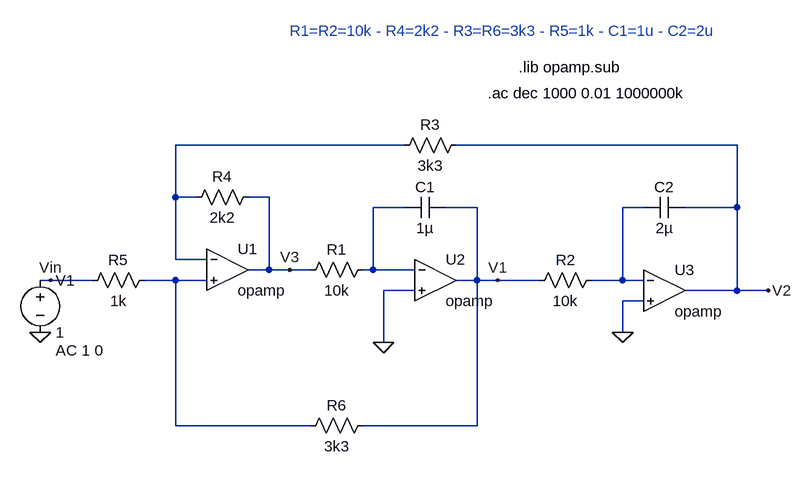
[diagram p0: schematic Ex5.asc]
Ex5.asc, the LTspice schematic file:
Version 4
SHEET 1 992 680
WIRE 384 -80 32 -80
WIRE 896 -80 464 -80
WIRE 32 0 32 -80
WIRE 64 0 32 0
WIRE 176 0 144 0
WIRE 384 16 336 16
WIRE 496 16 448 16
WIRE 752 16 720 16
WIRE 896 16 896 -80
WIRE 896 16 816 16
WIRE 32 96 32 0
WIRE 80 96 32 96
WIRE 176 112 176 0
WIRE 176 112 144 112
WIRE 208 112 176 112
WIRE 240 112 208 112
WIRE 336 112 336 16
WIRE 336 112 320 112
WIRE 400 112 336 112
WIRE -160 128 -176 128
WIRE -96 128 -160 128
WIRE 32 128 -16 128
WIRE 80 128 32 128
WIRE 496 128 496 16
WIRE 496 128 464 128
WIRE 528 128 496 128
WIRE 592 128 528 128
WIRE 720 128 720 16
WIRE 720 128 672 128
WIRE 752 128 720 128
WIRE 400 144 352 144
WIRE 896 144 896 16
WIRE 896 144 816 144
WIRE 944 144 896 144
WIRE 752 160 720 160
WIRE 720 208 720 160
WIRE 352 224 352 144
WIRE 32 352 32 128
WIRE 240 352 32 352
WIRE 496 352 496 128
WIRE 496 352 320 352
FLAG -176 208 0
FLAG 352 224 0
FLAG 720 208 0
FLAG 944 144 V2
FLAG 528 128 V1
FLAG 208 112 V3
FLAG -160 128 Vin
SYMBOL OpAmps\\opamp 112 48 R0
SYMATTR InstName U1
SYMBOL OpAmps\\opamp 432 64 R0
SYMATTR InstName U2
SYMBOL OpAmps\\opamp 784 80 R0
SYMATTR InstName U3
SYMBOL res 0 112 R90
WINDOW 0 0 56 VBottom 2
WINDOW 3 32 56 VTop 2
SYMATTR InstName R5
SYMATTR Value 1k
SYMBOL res 336 96 R90
WINDOW 0 0 56 VBottom 2
WINDOW 3 32 56 VTop 2
SYMATTR InstName R1
SYMATTR Value 10k
SYMBOL res 688 112 R90
WINDOW 0 0 56 VBottom 2
WINDOW 3 32 56 VTop 2
SYMATTR InstName R2
SYMATTR Value 10k
SYMBOL res 336 336 R90
WINDOW 0 0 56 VBottom 2
WINDOW 3 32 56 VTop 2
SYMATTR InstName R6
SYMATTR Value 3k3
SYMBOL res 160 -16 R90
WINDOW 0 0 56 VBottom 2
WINDOW 3 32 56 VTop 2
SYMATTR InstName R4
SYMATTR Value 2k2
SYMBOL res 480 -96 R90
WINDOW 0 0 56 VBottom 2
WINDOW 3 32 56 VTop 2
SYMATTR InstName R3
SYMATTR Value 3k3
SYMBOL cap 448 0 R90
WINDOW 0 0 32 VBottom 2
WINDOW 3 32 32 VTop 2
SYMATTR InstName C1
SYMATTR Value 1µ
SYMBOL cap 816 0 R90
WINDOW 0 0 32 VBottom 2
WINDOW 3 32 32 VTop 2
SYMATTR InstName C2
SYMATTR Value 2µ
SYMBOL voltage -176 112 R0
WINDOW 123 24 124 Left 2
WINDOW 39 0 0 Left 0
SYMATTR InstName V1
SYMATTR Value 1
SYMATTR Value2 AC 1 0
TEXT 560 -200 Left 2 !.lib opamp.sub
TEXT 512 -160 Left 2 !.ac dec 1000 0.01 1000000k
TEXT 208 -256 Left 2 ;R1=R2=10k - R4=2k2 - R3=R6=3k3 - R5=1k - C1=1u - C2=2u

The netlist it stands for:
* Ex5.asc
XU1 N001 N004 V3 opamp Aol=100K GBW=10Meg  ; pins invin noninvin out
XU2 N002 0 V1 opamp Aol=100K GBW=10Meg  ; pins invin noninvin out
XU3 N003 0 V2 opamp Aol=100K GBW=10Meg  ; pins invin noninvin out
R5 N004 Vin 1k
R1 N002 V3 10k
R2 N003 V1 10k
R6 V1 N004 3k3
R4 V3 N001 2k2
R3 V2 N001 3k3
C1 V1 N002 1µ
C2 V2 N003 2µ
V1 Vin 0 1 AC 1 0
.lib opamp.sub
.ac dec 1000 0.01 1000000k
* R1=R2=10k - R4=2k2 - R3=R6=3k3 - R5=1k - C1=1u - C2=2u
.backanno
.end